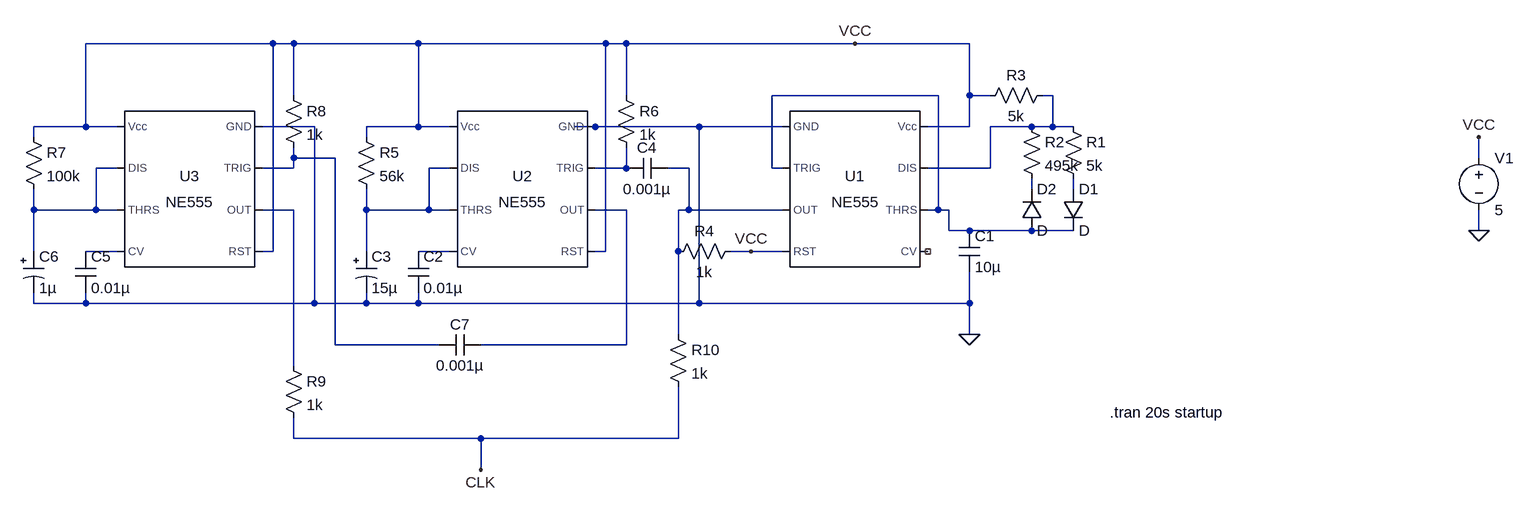
[diagram p0: schematic Cascaded Timer.asc]
Cascaded Timer.asc, the LTspice schematic file:
Version 4
SHEET 1 1224 704
WIRE -688 -48 -976 -48
WIRE -656 -48 -688 -48
WIRE -464 -48 -656 -48
WIRE -176 -48 -464 -48
WIRE -144 -48 -176 -48
WIRE 208 -48 -144 -48
WIRE 384 -48 208 -48
WIRE -656 32 -656 -48
WIRE -144 32 -144 -48
WIRE 336 32 80 32
WIRE 384 32 384 -48
WIRE 416 32 384 32
WIRE 512 32 496 32
WIRE -976 80 -976 -48
WIRE -976 80 -1056 80
WIRE -928 80 -976 80
WIRE -624 80 -704 80
WIRE -464 80 -464 -48
WIRE -464 80 -544 80
WIRE -416 80 -464 80
WIRE -192 80 -224 80
WIRE -32 80 -192 80
WIRE 96 80 -32 80
WIRE 384 80 384 32
WIRE 384 80 320 80
WIRE 480 80 416 80
WIRE 512 80 512 32
WIRE 512 80 480 80
WIRE 544 80 512 80
WIRE -1056 96 -1056 80
WIRE -544 96 -544 80
WIRE -656 128 -656 112
WIRE -592 128 -656 128
WIRE 1168 128 1168 96
WIRE -928 144 -960 144
WIRE -656 144 -656 128
WIRE -656 144 -704 144
WIRE -416 144 -448 144
WIRE -144 144 -144 112
WIRE -144 144 -192 144
WIRE -48 144 -80 144
WIRE 80 144 80 32
WIRE 96 144 80 144
WIRE 416 144 416 80
WIRE 416 144 320 144
WIRE 480 176 480 160
WIRE 544 176 544 160
WIRE -1056 208 -1056 176
WIRE -960 208 -960 144
WIRE -960 208 -1056 208
WIRE -928 208 -960 208
WIRE -656 208 -704 208
WIRE -544 208 -544 176
WIRE -448 208 -448 144
WIRE -448 208 -544 208
WIRE -416 208 -448 208
WIRE -144 208 -192 208
WIRE -48 208 -48 144
WIRE -48 208 -64 208
WIRE 96 208 -48 208
WIRE 336 208 336 32
WIRE 336 208 320 208
WIRE 352 208 336 208
WIRE 352 240 352 208
WIRE 384 240 352 240
WIRE 480 240 384 240
WIRE 544 240 480 240
WIRE 1168 240 1168 208
WIRE -1056 272 -1056 208
WIRE -928 272 -976 272
WIRE -688 272 -688 -48
WIRE -688 272 -704 272
WIRE -544 272 -544 208
WIRE -416 272 -464 272
WIRE -176 272 -176 -48
WIRE -176 272 -192 272
WIRE -64 272 -64 208
WIRE 48 272 16 272
WIRE 96 272 48 272
WIRE -1056 352 -1056 336
WIRE -976 352 -976 336
WIRE -976 352 -1056 352
WIRE -624 352 -624 80
WIRE -624 352 -976 352
WIRE -544 352 -544 336
WIRE -544 352 -624 352
WIRE -464 352 -464 336
WIRE -464 352 -544 352
WIRE -32 352 -32 80
WIRE -32 352 -464 352
WIRE 384 352 384 304
WIRE 384 352 -32 352
WIRE -64 400 -64 272
WIRE 384 400 384 352
WIRE -592 416 -592 128
WIRE -432 416 -592 416
WIRE -144 416 -144 208
WIRE -144 416 -368 416
WIRE -656 448 -656 208
WIRE -656 560 -656 528
WIRE -368 560 -656 560
WIRE -64 560 -64 480
WIRE -64 560 -368 560
WIRE -368 608 -368 560
FLAG 1168 240 0
FLAG 1168 96 VCC
FLAG 208 -48 VCC
FLAG 48 272 VCC
FLAG 384 400 0
FLAG -368 608 CLK
SYMBOL Misc\\NE555 208 176 R0
SYMATTR InstName U1
SYMBOL voltage 1168 112 R0
WINDOW 123 0 0 Left 0
WINDOW 39 0 0 Left 0
SYMATTR InstName V1
SYMATTR Value 5
SYMBOL cap 368 240 R0
SYMATTR InstName C1
SYMATTR Value 10µ
SYMBOL res 528 64 R0
SYMATTR InstName R1
SYMATTR Value 5k
SYMBOL res 464 64 R0
SYMATTR InstName R2
SYMATTR Value 495k
SYMBOL diode 528 176 R0
SYMATTR InstName D1
SYMBOL diode 464 240 M180
WINDOW 0 24 64 Left 2
WINDOW 3 24 0 Left 2
SYMATTR InstName D2
SYMBOL res 512 16 R90
WINDOW 0 0 56 VBottom 2
WINDOW 3 32 56 VTop 2
SYMATTR InstName R3
SYMATTR Value 5k
SYMBOL res 32 256 R90
WINDOW 0 0 56 VBottom 2
WINDOW 3 32 56 VTop 2
SYMATTR InstName R4
SYMATTR Value 1k
SYMBOL Misc\\NE555 -304 176 M0
SYMATTR InstName U2
SYMBOL cap -480 272 R0
SYMATTR InstName C2
SYMATTR Value 0.01µ
SYMBOL polcap -560 272 R0
WINDOW 3 24 56 Left 2
SYMATTR Value 15µ
SYMATTR InstName C3
SYMATTR Description Capacitor
SYMATTR Type cap
SYMATTR SpiceLine V=12.5 Irms=2.44949 Rser=0.045 Lser=0 mfg="KEMET" pn="A700V156M12RATE045" type="Al electrolytic"
SYMBOL res -560 80 R0
SYMATTR InstName R5
SYMATTR Value 56k
SYMBOL cap -80 128 R90
WINDOW 0 0 32 VBottom 2
WINDOW 3 32 32 VTop 2
SYMATTR InstName C4
SYMATTR Value 0.001µ
SYMBOL res -160 16 R0
SYMATTR InstName R6
SYMATTR Value 1k
SYMBOL Misc\\NE555 -816 176 M0
SYMATTR InstName U3
SYMBOL cap -992 272 R0
SYMATTR InstName C5
SYMATTR Value 0.01µ
SYMBOL polcap -1072 272 R0
WINDOW 3 24 56 Left 2
SYMATTR Value 1µ
SYMATTR InstName C6
SYMATTR Description Capacitor
SYMATTR Type cap
SYMATTR SpiceLine V=12.5 Irms=2.44949 Rser=0.045 Lser=0
SYMBOL res -1072 80 R0
SYMATTR InstName R7
SYMATTR Value 100k
SYMBOL res -672 16 R0
SYMATTR InstName R8
SYMATTR Value 1k
SYMBOL cap -368 400 R90
WINDOW 0 0 32 VBottom 2
WINDOW 3 32 32 VTop 2
SYMATTR InstName C7
SYMATTR Value 0.001µ
SYMBOL res -672 432 R0
SYMATTR InstName R9
SYMATTR Value 1k
SYMBOL res -80 384 R0
SYMATTR InstName R10
SYMATTR Value 1k
TEXT 600 520 Left 2 !.tran 20s startup

The netlist it stands for:
* Cascaded Timer.asc
XU1 0 N001 N007 VCC NC_01 N001 N002 VCC NE555  ; pins GND TRIG OUT RST CV THRS DIS Vcc
V1 VCC 0 5
C1 N001 0 10µ
R1 N002 N009 5k
R2 N002 N008 495k
D1 N009 N001 D
D2 N001 N008 D
R3 N002 VCC 5k
R4 VCC N007 1k
XU2 0 N006 N011 VCC N013 N005 N005 VCC NE555  ; pins GND TRIG OUT RST CV THRS DIS Vcc
C2 N013 0 0.01µ
C3 N005 0 15µ V=12.5 Irms=2.44949 Rser=0.045 Lser=0 mfg="KEMET" pn="A700V156M12RATE045" type="Al electrolytic"
R5 VCC N005 56k
C4 N007 N006 0.001µ
R6 VCC N006 1k
XU3 0 N003 N010 VCC N012 N004 N004 VCC NE555  ; pins GND TRIG OUT RST CV THRS DIS Vcc
C5 N012 0 0.01µ
C6 N004 0 1µ V=12.5 Irms=2.44949 Rser=0.045 Lser=0
R7 VCC N004 100k
R8 VCC N003 1k
C7 N011 N003 0.001µ
R9 N010 CLK 1k
R10 N007 CLK 1k
.model D D
.lib standard.dio
.tran 20s startup
.lib NE555.sub
.backanno
.end

* Results of the author's LTspice run, read from the files saved beside the schematic
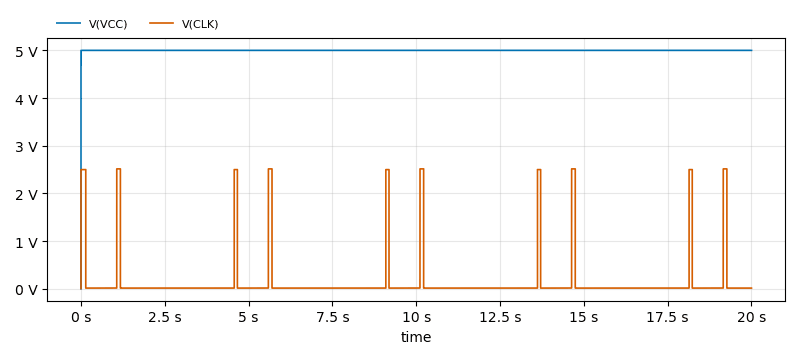
[diagram p1: Transient Analysis of Cascaded Timer.asc, plotted from the saved traces]
* Transient Analysis, 1 run:
*   V(VCC): min 0 V, max 5 V, average 5 V, rms 5 V, last 5 V
*   V(CLK): min 0 V, max 2.515 V, average 148.1 mV, rms 579.8 mV, last 14.94 mV